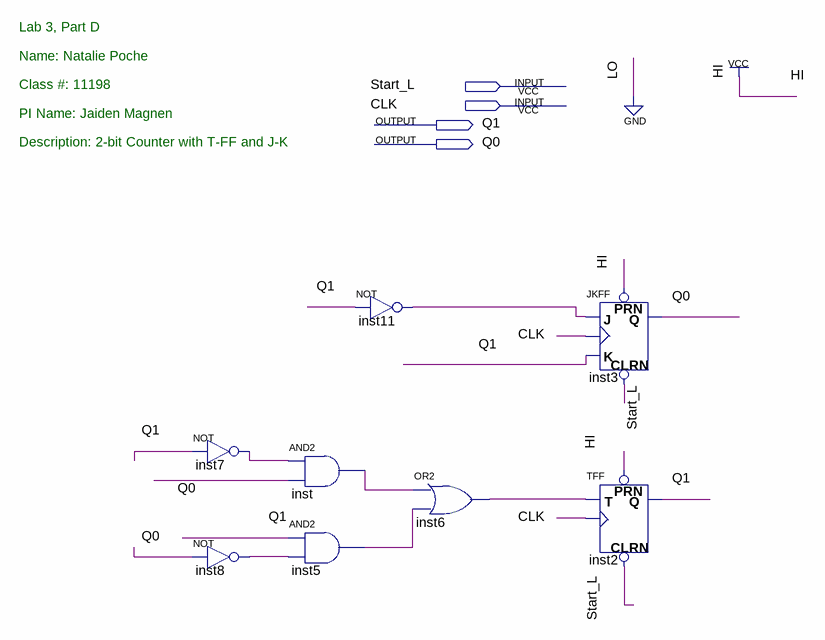
[diagram p0: schematic sheet]
// Quartus schematic Lab3_2bit_JK_T.bdf as structural Verilog: 8 symbols, 4 pins
module Lab3_2bit_JK_T (
  input  Start_L,
  input  CLK,
  output Q1,
  output Q0
);

  wire inst5_out, inst6_out, inst7_out, inst8_out, inst11_out, inst_out;

  not inst7 (inst7_out, Q1);
  not inst8 (inst8_out, Q0);
  and inst (inst_out, inst7_out, Q0);
  and inst5 (inst5_out, Q1, inst8_out);
  not inst11 (inst11_out, Q1);
  or inst6 (inst6_out, inst_out, inst5_out);
  JKFF inst3 (.PRN(1'b1), .CLRN(Start_L), .K(Q1), .J(inst11_out), .CLK(CLK), .Q(Q0));
  TFF inst2 (.PRN(1'b1), .CLRN(Start_L), .T(inst6_out), .CLK(CLK), .Q(Q1));

  // Notes on the sheet:
  //   Lab 3, Part D
  //   Name: Natalie Poche
  //   Class #: 11198
  //   PI Name: Jaiden Magnen
  //   Description: 2-bit Counter with T-FF and J-K
endmodule
